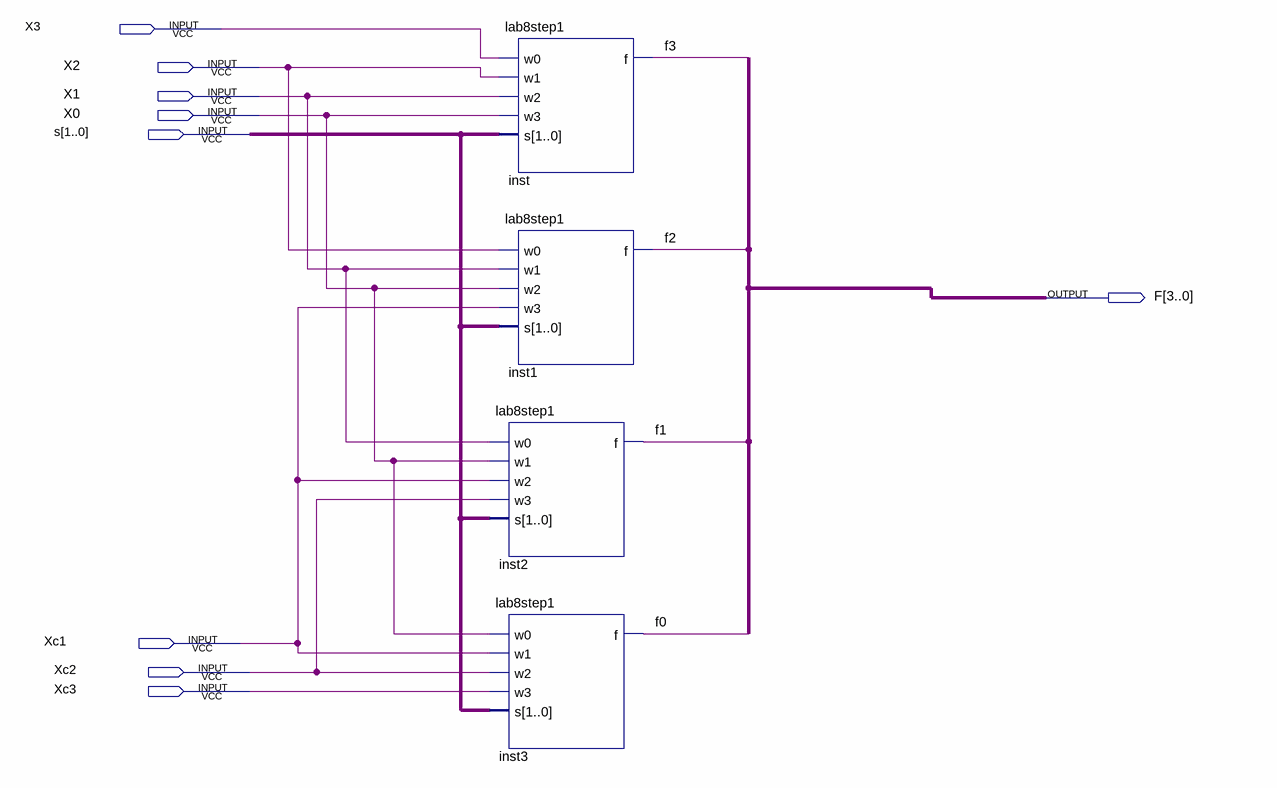
[diagram p0: schematic sheet]
// Quartus schematic lab8step2.bdf as structural Verilog: 4 symbols, 9 pins
module lab8step2 (
  input  X3,
  input  X2,
  input  X1,
  input  X0,
  input  [1:0] s,
  input  Xc1,
  input  Xc2,
  input  Xc3,
  output [3:0] F
);

  lab8step1 inst (.w0(X3), .w1(X2), .w2(X1), .w3(X0), .s(s), .f(F[3]));
  lab8step1 inst1 (.w0(X2), .w1(X1), .w2(X0), .w3(Xc1), .s(s), .f(F[2]));
  lab8step1 inst2 (.w0(X1), .w1(X0), .w2(Xc1), .w3(Xc2), .s(s), .f(F[1]));
  lab8step1 inst3 (.w0(X0), .w1(Xc1), .w2(Xc2), .w3(Xc3), .s(s), .f(F[0]));
endmodule
